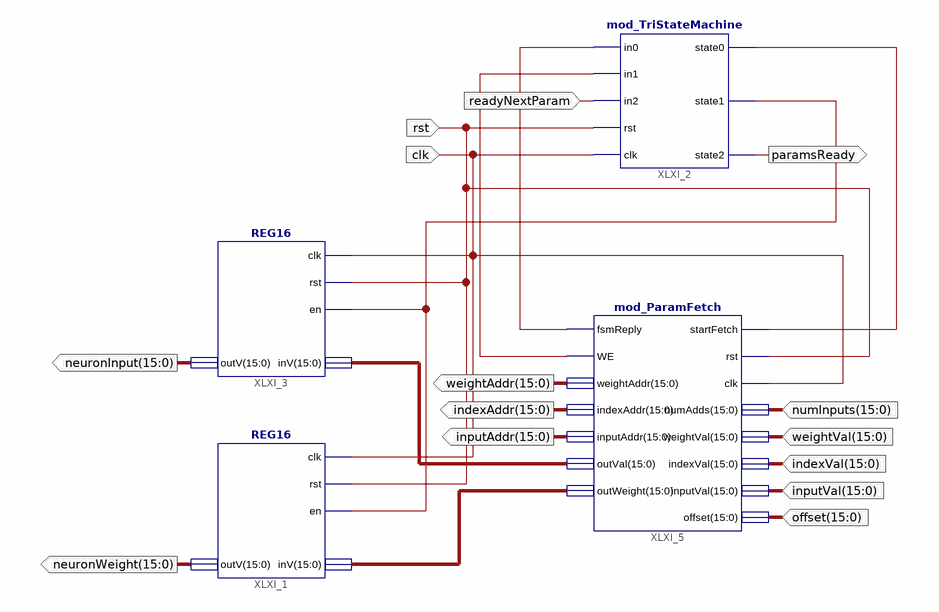
[diagram p0: schematic sheet 1]
// Xilinx ISE schematic mod_ParamFetchStageNEW.sch (spartan3e) as structural Verilog: 4 symbols, 14 ports
module mod_ParamFetchStageNEW (
  input  clk,
  input  rst,
  input  readyNextParam,
  input  [15:0] numInputs,
  input  [15:0] weightVal,
  input  [15:0] indexVal,
  input  [15:0] inputVal,
  input  [15:0] offset,
  output [15:0] neuronInput,
  output [15:0] neuronWeight,
  output [15:0] weightAddr,
  output [15:0] indexAddr,
  output [15:0] inputAddr,
  output paramsReady
);

  wire XLXN_1, XLXN_4, XLXN_7, XLXN_8;
  wire [15:0] XLXN_5, XLXN_6;

  REG16 XLXI_1 (.clk(clk), .rst(rst), .en(XLXN_4), .inV(XLXN_6), .outV(neuronWeight));
  mod_TriStateMachine XLXI_2 (
    .in0(XLXN_8), .in1(XLXN_7), .in2(readyNextParam), .rst(rst), .clk(clk), .state0(XLXN_1), .state1(XLXN_4),
    .state2(paramsReady));
  REG16 XLXI_3 (.clk(clk), .rst(rst), .en(XLXN_4), .inV(XLXN_5), .outV(neuronInput));
  mod_ParamFetch XLXI_5 (
    .startFetch(XLXN_1), .rst(rst), .clk(clk), .numAdds(numInputs), .offset(offset), .weightVal(weightVal),
    .indexVal(indexVal), .inputVal(inputVal), .fsmReply(XLXN_8), .WE(XLXN_7), .weightAddr(weightAddr),
    .indexAddr(indexAddr), .inputAddr(inputAddr), .outVal(XLXN_5), .outWeight(XLXN_6));
endmodule
